# Altium schematic sheet Sheet3.SchDoc
size A; SheetNumber: 3; SheetTotal: 3
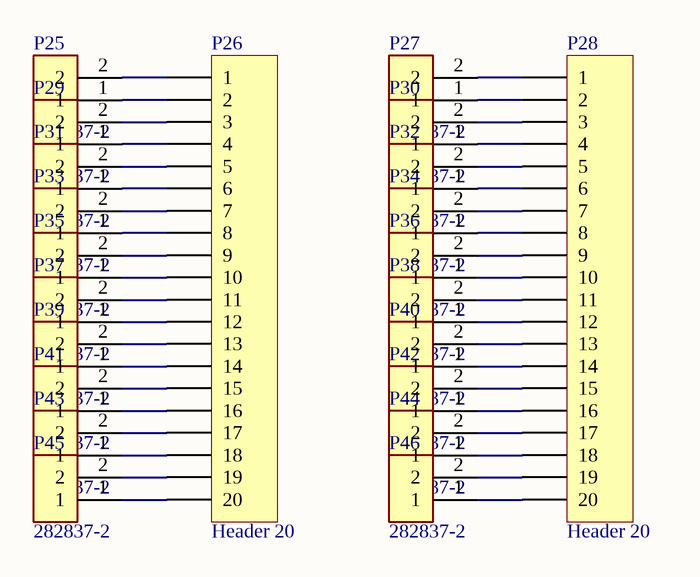
[diagram p0: Sheet3.SchDoc]

## Parts
P25  282837-2  [TE_282837-2]
P26  Header 20  [HDR1X20]
P27  282837-2  [TE_282837-2]
P28  Header 20  [HDR1X20]
P29  282837-2  [TE_282837-2]
P30  282837-2  [TE_282837-2]
P31  282837-2  [TE_282837-2]
P32  282837-2  [TE_282837-2]
P33  282837-2  [TE_282837-2]
P34  282837-2  [TE_282837-2]
P35  282837-2  [TE_282837-2]
P36  282837-2  [TE_282837-2]
P37  282837-2  [TE_282837-2]
P38  282837-2  [TE_282837-2]
P39  282837-2  [TE_282837-2]
P40  282837-2  [TE_282837-2]
P41  282837-2  [TE_282837-2]
P42  282837-2  [TE_282837-2]
P43  282837-2  [TE_282837-2]
P44  282837-2  [TE_282837-2]
P45  282837-2  [TE_282837-2]
P46  282837-2  [TE_282837-2]

## Nets
NetP25_1: P25.1 P26.2
NetP25_2: P25.2 P26.1
NetP26_3: P26.3 P29.2
NetP26_4: P26.4 P29.1
NetP26_5: P26.5 P31.2
NetP26_6: P26.6 P31.1
NetP26_7: P26.7 P33.2
NetP26_8: P26.8 P33.1
NetP26_9: P26.9 P35.2
NetP26_10: P26.10 P35.1
NetP26_11: P26.11 P37.2
NetP26_12: P26.12 P37.1
NetP26_13: P26.13 P39.2
NetP26_14: P26.14 P39.1
NetP26_15: P26.15 P41.2
NetP26_16: P26.16 P41.1
NetP26_17: P26.17 P43.2
NetP26_18: P26.18 P43.1
NetP26_19: P26.19 P45.2
NetP26_20: P26.20 P45.1
NetP27_1: P27.1 P28.2
NetP27_2: P27.2 P28.1
NetP28_3: P28.3 P30.2
NetP28_4: P28.4 P30.1
NetP28_5: P28.5 P32.2
NetP28_6: P28.6 P32.1
NetP28_7: P28.7 P34.2
NetP28_8: P28.8 P34.1
NetP28_9: P28.9 P36.2
NetP28_10: P28.10 P36.1
NetP28_11: P28.11 P38.2
NetP28_12: P28.12 P38.1
NetP28_13: P28.13 P40.2
NetP28_14: P28.14 P40.1
NetP28_15: P28.15 P42.2
NetP28_16: P28.16 P42.1
NetP28_17: P28.17 P44.2
NetP28_18: P28.18 P44.1
NetP28_19: P28.19 P46.2
NetP28_20: P28.20 P46.1

## Library data of the parts
P25 P27 P29-P46 = 282837-2: Ð Ð°Ð·ÑŠÐµÐ¼Ð½Ñ‹Ðµ ÐºÐ»ÐµÐ¼Ð¼Ð½Ñ‹Ðµ ÐºÐ¾Ð»Ð¾Ð´ÐºÐ¸ Ð Ð¾Ð·ÐµÑ‚ÐºÐ° 2 Ð¿Ð¾Ð»Ð¾Ð¶ÐµÐ½Ð¸Ñ 5,08 Ð¼Ð¼ ÐŸÑ€Ð¸Ð¿Ð¾Ð¹ Ð¿Ñ€ÑÐ¼Ð¾Ð¹ Ñ‡ÐµÑ€ÐµÐ· Ð¾Ñ‚Ð²ÐµÑ€ÑÑ‚Ð¸Ðµ 13,5 Ð / ÐºÐ¾Ð½Ñ‚Ð°ÐºÑ‚; MF: TE Connectivity; Price: None; Check_prices: https://www.snapeda.com/parts/282837-2/TE+Connectivity+AMP+Connectors/view-part/?ref=eda; Purchase-URL: https://pricing.snapeda.com/search/part/282837-2/?ref=eda; MP: 282837-2; Value: *; Availability: In Stock; Package: None
  P25 P27 P29-P45: SnapEDA_Link: https://www.snapeda.com/parts/282837-2/TE+Connectivity+AMP+Connectors/view-part/?ref=snap
P26 P28 = Header 20: Header, 20-Pin; LatestRevisionDate: 17-Jul-2002; LatestRevisionNote: Re-released for DXP Platform.; Publisher: Altium Limited